# EAGLE design Stun (EAGLE 6.6.0)
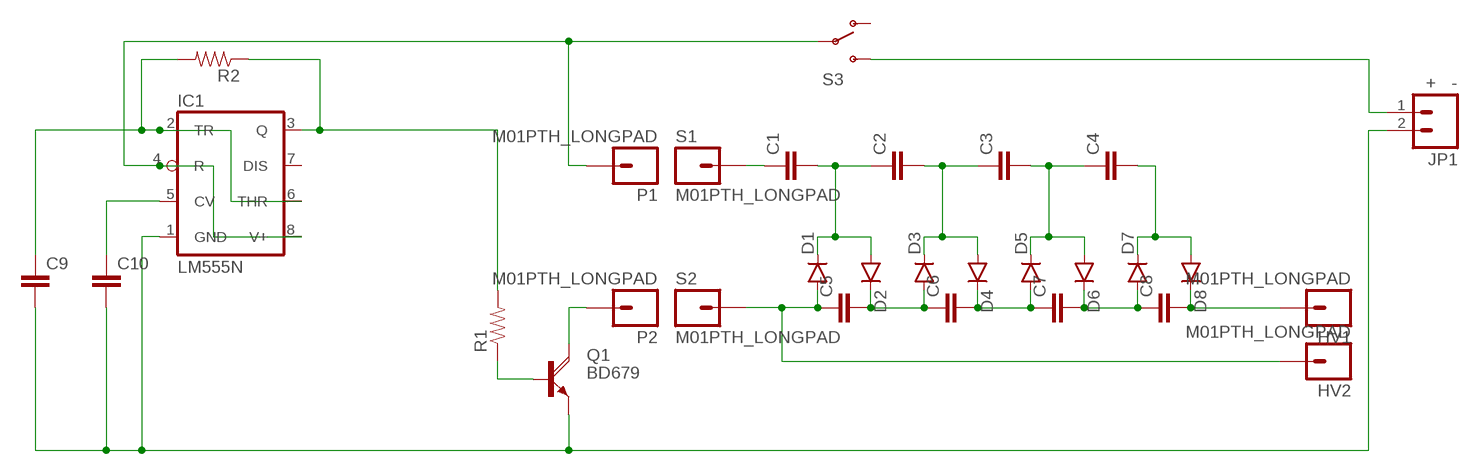
[diagram p0: schematic, sheet 1]

## Parts
C1  CAPPTH1  [CAP-PTH-5MM]
C2  CAPPTH1  [CAP-PTH-5MM]
C3  CAPPTH1  [CAP-PTH-5MM]
C4  CAPPTH1  [CAP-PTH-5MM]
C5  CAPPTH1  [CAP-PTH-5MM]
C6  CAPPTH1  [CAP-PTH-5MM]
C7  CAPPTH1  [CAP-PTH-5MM]
C8  CAPPTH1  [CAP-PTH-5MM]
C9  0.1UF-50V-20%(PTH)KIT-EZ  [CAP-PTH-SMALL-KIT]
C10  0.1UF-50V-20%(PTH)KIT-EZ  [CAP-PTH-SMALL-KIT]
D1  DIODE  [DIODE-1N4001-KIT]
D2  DIODE  [DIODE-1N4001-KIT]
D3  DIODE  [DIODE-1N4001-KIT]
D4  DIODE  [DIODE-1N4001-KIT]
D5  DIODE  [DIODE-1N4001-KIT]
D6  DIODE  [DIODE-1N4001-KIT]
D7  DIODE  [DIODE-1N4001-KIT]
D8  DIODE  [DIODE-1N4001-KIT]
HV1  M01PTH_LONGPAD  [1X01_LONGPAD]
HV2  M01PTH_LONGPAD  [1X01_LONGPAD]
IC1  LM555N  [DIL08-ROUND]
JP1  + -  M02PTH  [1X02]
P1  M01PTH_LONGPAD  [1X01_LONGPAD]
P2  M01PTH_LONGPAD  [1X01_LONGPAD]
Q1  BD679  [TO126AV]
R1  RESISTORPTH-1/4W  [AXIAL-0.4]
R2  RESISTORPTH-1/4W  [AXIAL-0.4]
S1  M01PTH_LONGPAD  [1X01_LONGPAD]
S2  M01PTH_LONGPAD  [1X01_LONGPAD]
S3  SWITCH-SPDTPTH  [SWITCH-SPDT]

## Nets
12V: JP1.1 S3.3(S)
GND: C9.2 C10.2 IC1.1(GND) JP1.2 Q1.E
N$2: C5.1 D1.A HV2.1 S2.1
N$3: C5.2 C6.1 D2.C D3.A
N$5: Q1.B R1.P$1
N$6: C6.2 C7.1 D4.C D5.A
N$7: IC1.3(Q) R1.P$2 R2.P$1
N$8: C9.1 IC1.2(TR) IC1.6(THR) R2.P$2
N$9: C7.2 C8.1 D6.C D7.A
N$10: C4.2 D7.C D8.A
N$12: C8.2 D8.C HV1.1
N$13: C1.2 C2.1 D1.C D2.A
N$14: C2.2 C3.1 D3.C D4.A
N$15: C3.2 C4.1 D5.C D6.A
N$16: C1.1 S1.1
N$17: P2.1 Q1.C
N$18: IC1.4(R) IC1.8(V+) P1.1 S3.2(P)
N$20: C10.1 IC1.5(CV)
Unconnected: IC1.7(DIS) S3.1(O)

## Library data of the parts
C1-C8 = SparkFun-Capacitors:CAP: Capacitor Standard 0603 ceramic capacitor, and 0.1" leaded capacitor.
C9 C10 = SparkFun-Capacitors:0.1UF-50V-20%(PTH): CAP-08370; PROD_ID: CAP-08370
D1-D8 = SparkFun-DiscreteSemi:DIODE: Diode These are standard reverse protection diodes and small signal diodes. SMA package can handle up to about 1A. SOD-323 can handle about 200mA. What the SOD-323 package when ordering, there are some mfgs out there that are 5-pin packages.
HV1 HV2 P1 P2 S1 S2 = SparkFun-Connectors:M01: Header 1 Standard 1-pin 0.1" header. Use with straight break away headers (SKU : PRT-00116), right angle break away headers (PRT-00553), swiss pins (PRT-00743), machine pins (PRT-00117), and female headers (PRT-00115).
IC1 = adafruit:*555: TIMER Changed DIP package to have round (not oval) pin pads http://www.ladyada.net/library/pcb/eaglelibrary.html
JP1 = SparkFun-Connectors:M02: Standard 2-pin 0.1" header. Use with - straight break away headers ( PRT-00116) - right angle break away headers (PRT-00553) - swiss pins (PRT-00743) - machine pins (PRT-00117) - female headers (PRT-00115) Molex polarized connector foot print use with: PRT-08233 with associated crimp pins and housings. 2.54_SCREWTERM for use with PRT-10571. 3.5mm Screw Terminal footprints for PRT-08084 5mm Screw Terminal footprints for use with PRT-08433
Q1 = transistor-power:BD679: NPN DARLINGTON TRANSISTOR
R1 R2 = SparkFun-Resistors:RESISTOR: Resistor Basic schematic elements and footprints for 0603, 1206, and PTH resistors.
S3 = SparkFun-Electromechanical:SWITCH-SPDT: SPDT Switch Simple slide switch, Spark Fun Electronics SKU : COM-00102 DPDT SMT slide switch, AYZ0202, SWCH-08179

## Board
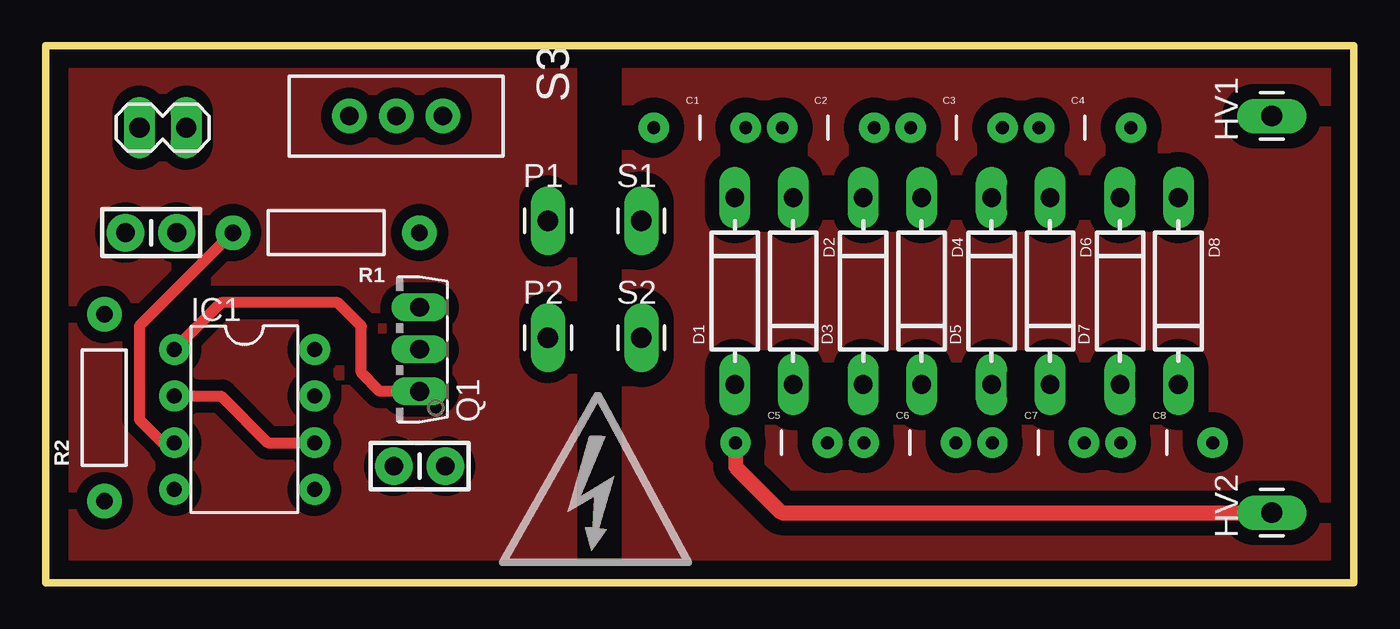
[diagram p1: board, top side]
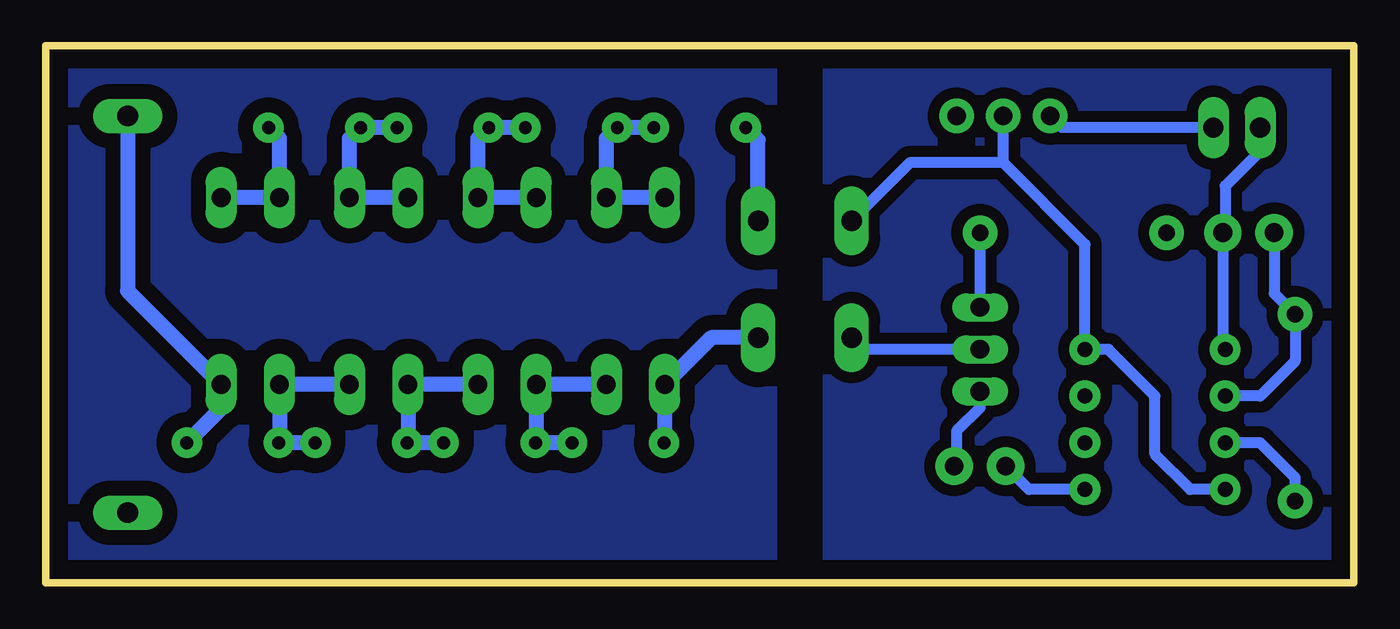
[diagram p2: board, bottom side, seen from below]

Size 71.12 x 29.21 mm. Coordinates in mm from the lower left corner, seen from the top.
Outline: 0,0 71.12,0 71.12,29.21 0,29.21 0,0
Copper layers (1*16): Top 0.035mm / dielectric 1.5mm / Bottom 0.035mm
Design rules "default": minimum track width 10mil, minimum drill 24mil, track to track 8mil, track to pad 8mil, pad to pad 8mil, via to via 8mil, smd to smd 8mil, copper to edge 40mil, drill to drill 8mil, minimum pad ring 10mil, minimum via ring 8mil, stop-mask expansion 4mil, vias tented up to drill 0mil, thermal gap 10mil

### Footprints (pad centres in the part's own frame; a part is rotated, then mirrored left to right if it is on the bottom)
CAP-PTH-5MM = drill 0.7 pad 1.651: 1 -2.5,0; 2 2.5,0
CAP-PTH-SMALL-KIT = drill 1.016 pad 2.032: 1 -1.397,0; 2 1.397,0
DIODE-1N4001-KIT = drill 1.016 pad 1.676 long: A -5.08,0; C 5.08,0
1X01_LONGPAD = drill 1.118 pad 1.88 long: 1 0,0
DIL08-ROUND = drill 0.813 pad 1.676: 1 -3.81,-3.81; 2 -1.27,-3.81; 3 1.27,-3.81; 4 3.81,-3.81; 5 3.81,3.81; 6 1.27,3.81; 7 -1.27,3.81; 8 -3.81,3.81
1X02 = drill 1.1 pad 1.676 long: 1 0,0; 2 2.54,0
TO126AV = drill 1.016 long: B 2.286,-1.27; C 0,-1.27; E -2.286,-1.27
AXIAL-0.4 = drill 0.9 pad 1.88: P$1 -5.08,0; P$2 5.08,0
SWITCH-SPDT = drill 1.016 pad 1.88: 1 0,2.54; 2 0,0; 3 0,-2.54

### Placement (x,y rotation side)
C1  35.56,24.77 0 top
C2  42.55,24.77 0 top
C3  49.53,24.77 0 top
C4  56.52,24.77 0 top
C5  40.01,7.62 0 top
C6  46.99,7.62 0 top
C7  53.98,7.62 0 top
C8  60.96,7.62 0 top
C9  5.71,19.05 0 top
C10  20.32,6.35 0 top
D1  37.47,15.88 90 top
D2  40.64,15.88 270 top
D3  44.45,15.88 90 top
D4  47.62,15.88 270 top
D5  51.44,15.88 90 top
D6  54.61,15.88 270 top
D7  58.42,15.88 90 top
D8  61.59,15.88 270 top
HV1  66.67,25.4 90 top
HV2  66.67,3.81 90 top
IC1  10.79,8.89 270 top
JP1  7.62,24.77 180 top
P1  27.3,19.68 0 top
P2  27.3,13.34 0 top
Q1  19.05,12.7 90 top
R1  15.24,19.05 180 top
R2  3.17,9.53 90 top
S1  32.38,19.68 0 top
S2  32.38,13.34 0 top
S3  19.05,25.4 270 top

### Tracks (layer width: path | path; a pad name or v marks a point on that pad's centre or on a via)
12V
  Bottom 0.61: JP1.1 15.88,24.77 S3.3
GND
  Top 0.61: Q1.E 18.16,10.41 17.14,11.43 17.14,13.97 15.88,15.24 9.53,15.24 IC1.1
  Bottom 0.61: Q1.E 20.32,9.53 21.59,8.26 21.59,6.48 C10.2 | IC1.1 7.11,12.83 C9.2 6.99,19.18 6.99,21.59 5.08,23.5 JP1.2
N$1
  pour Top (isolate 0.61): 0,29.21 28.57,29.21 28.57,0 0,0
N$2
  Top 0.813: C5.1 37.51,6.31 40.01,3.81 HV2.1
  Bottom 0.813: S2.1 34.92,13.34 D1.A 37.47,7.66 C5.1
N$3
  Bottom 0.813: C5.2 C6.1 44.45,7.66 D3.A D2.C
N$4
  pour Bottom (isolate 0.61): 0,29.21 28.57,29.21 28.57,0.64 0,0
N$5
  Bottom 0.61: R1.P$1 Q1.B
N$6
  Bottom 0.813: C6.2 C7.1 51.44,7.66 D5.A D4.C
N$7
  Top 0.61: R1.P$2 5.08,13.97 5.08,8.89 6.35,7.62 IC1.3
  Bottom 0.61: R2.P$1 3.17,5.71 5.08,7.62 IC1.3
N$8
  Top 0.61: IC1.2 9.53,10.16 12.06,7.62 IC1.6
  Bottom 0.61: IC1.2 5.08,10.16 3.17,12.06 R2.P$2 4.32,15.75 C9.1
N$9
  Bottom 0.813: C7.2 C8.1 58.42,7.66 D7.A D6.C
N$10
  Bottom 0.813: D8.A D7.C 58.42,24.17 C4.2
N$11
  pour Bottom (isolate 0.813): 31.75,29.21 71.12,29.21 71.12,0 31.75,0
  pour Top (isolate 0.813): 31.75,29.21 71.12,29.21 71.12,0 31.75,0
N$12
  Bottom 0.813: C8.2 61.59,9.48 D8.C 66.67,15.88 HV1.1
N$13
  Bottom 0.813: D1.C D2.A 40.64,24.17 C2.1 C1.2
N$14
  Bottom 0.813: D3.C D4.A 47.62,24.17 C3.1 C2.2
N$15
  Bottom 0.813: D5.C D6.A 54.61,24.17 C4.1 C3.2
N$16
  Bottom 0.813: S1.1 32.38,24.09 C1.1
N$17
  Bottom 0.61: Q1.C 26.67,12.7 P2.1
N$18
  Bottom 0.61: 19.05,22.86 14.61,18.41 IC1.8 13.34,12.7 10.79,10.16 10.79,6.99 8.89,5.08 IC1.4 | 19.05,22.86 S3.2 | 19.05,22.86 24.13,22.86 P1.1
N$20
  Bottom 0.61: IC1.5 17.65,5.08 C10.1